# Altium project L电感测试仪.PRJPCB
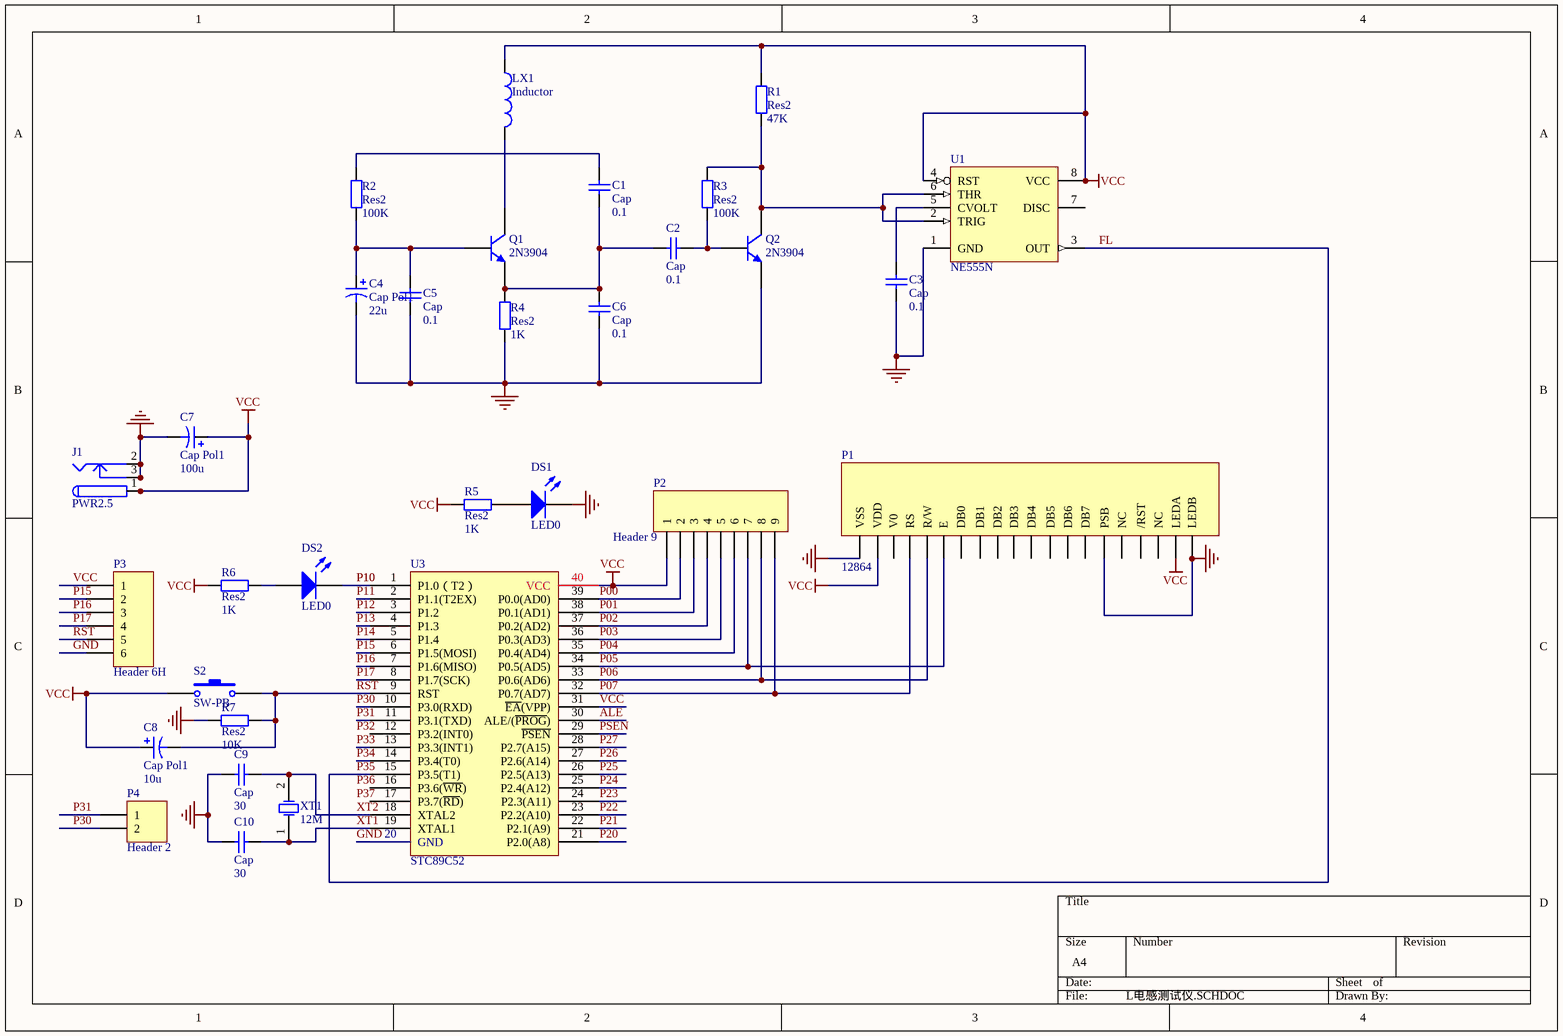
[diagram p0: L电感测试仪.SCHDOC]
1 sheet, 31 parts. Net scope: global (net labels, ports and power ports of the same name join across sheets).
Board file: L电感测试仪.PCBDOC

## Sheet L电感测试仪.SCHDOC
size A4

### Parts
C1  Cap  value 0.1  [RAD-0.2]
C2  Cap  value 0.1  [RAD-0.2]
C3  Cap  value 0.1  [RAD-0.2]
C4  Cap Pol1  value 22u  [电容]
C5  Cap  value 0.1  [RAD-0.2]
C6  Cap  value 0.1  [RAD-0.2]
C7  Cap Pol1  value 100u  [电容]
C8  Cap Pol1  value 10u  [电容]
C9  Cap  value 30  [RAD-0.1]
C10  Cap  value 30  [RAD-0.1]
DS1  LED0  [RAD-0.1]
DS2  LED0  [RAD-0.1]
J1  PWR2.5  [KLD-0202]
LX1  Inductor  [RAD-0.3]
P1  12864  [HDR1X20]
P2  Header 9  [HDR1X9]
P3  Header 6H  [HDR1X6]
P4  Header 2  [HDR1X2]
Q1  2N3904  [BCY-W3/E4]
Q2  2N3904  [BCY-W3/E4]
R1  Res2  value 47K  [AXIAL-0.4]
R2  Res2  value 100K  [AXIAL-0.4]
R3  Res2  value 100K  [AXIAL-0.4]
R4  Res2  value 1K  [AXIAL-0.4]
R5  Res2  value 1K  [AXIAL-0.4]
R6  Res2  value 1K  [AXIAL-0.4]
R7  Res2  value 10K  [AXIAL-0.4]
S2  SW-PB  [点动按键]
U1  NE555N  [DIP8]
U3  STC89C52  [AT89S52]
XT1  12M  [圆晶振]

### Nets
GND: C3.2 C4.2 C5.1 C6.1 C7.2 C9.1 C10.1 DS1.2(K) J1.2 J1.2A J1.2B J1.3 J1.3A J1.3B P1.1(VSS) P1.15(PSB) P1.20(LEDB) P3.6 Q2.1(E) R4.1 R7.1 U1.1(GND) U3.20(GND)
VCC: C7.1 C8.1 J1.1 J1.1A J1.1B LX1.1 P1.2(VDD) P1.19(LEDA) P2.1 P3.1 R1.2 R5.1 R6.2 S2.1 U1.4(RST) U1.8(VCC) U3.31(~{EA}(VPP)) U3.40(VCC)
ALE: U3.30(ALE/(~{PROG}))
FL: U1.3(OUT) U3.15(P3.5(T1))  [also labelled P35]
P00: P2.2 U3.39(P0.0(AD0))
P01: P2.3 U3.38(P0.1(AD1))
P02: P2.4 U3.37(P0.2(AD2))
P03: P2.5 U3.36(P0.3(AD3))
P04: P2.6 U3.35(P0.4(AD4))
P05: P1.6(E) P2.7 U3.34(P0.5(AD5))
P06: P1.5(R/W) P2.8 U3.33(P0.6(AD6))
P07: P1.4(RS) P2.9 U3.32(P0.7(AD7))
P10: DS2.2(K) U3.1(P1.0（T2）)
P11: U3.2(P1.1(T2EX))
P12: U3.3(P1.2)
P13: U3.4(P1.3)
P14: U3.5(P1.4)
P15: P3.2 U3.6(P1.5(MOSI))
P16: P3.3 U3.7(P1.6(MISO))
P17: P3.4 U3.8(P1.7(SCK))
P20: U3.21(P2.0(A8))
P21: U3.22(P2.1(A9))
P22: U3.23(P2.2(A10))
P23: U3.24(P2.3(A11))
P24: U3.25(P2.4(A12))
P25: U3.26(P2.5(A13))
P26: U3.27(P2.6(A14))
P27: U3.28(P2.7(A15))
P30: P4.2 U3.10(P3.0(RXD))
P31: P4.1 U3.11(P3.1(TXD))
P33: U3.13(P3.3(INT1))
P34: U3.14(P3.4(T0))
PSEN: U3.29(~{PSEN})
RST: C8.2 P3.5 R7.2 S2.2 U3.9(RST)
XT1: C10.2 U3.19(XTAL1) XT1.1(OSC1)
XT2: C9.2 U3.18(XTAL2) XT1.2(OSC2)
NetC1_1: C1.1 C2.2 C6.2 Q1.1(E) R4.2
NetC1_2: C1.2 R2.2
NetC2_1: C2.1 Q2.2(B) R3.2
NetC3_1: C3.1 U1.5(CVOLT)
NetC4_1: C4.1 C5.2 Q1.2(B) R2.1
NetDS1_1: DS1.1(A) R5.2
NetDS2_1: DS2.1(A) R6.1
NetLX1_2: LX1.2 Q1.3(C)
NetQ2_3: Q2.3(C) R1.1 R3.1 U1.2(TRIG) U1.6(THR)

Not connected (* = marked no-connect by the designer): P1 3(V0) 7(DB0) 8(DB1) 9(DB2) 10(DB3) 11(DB4) 12(DB5) 13(DB6) 14(DB7) 16(NC) 17(/RST) 18(NC); U1 7(DISC); U3 12(P3.2(INT0)) 16(P3.6(~{WR})) 17(P3.7(~{RD}))

### Notes on the sheet
- Labels drawn without touching a wire or pin: P32, P36, P37

### Library data of the parts
C1-C3 C5 C6 C9 C10 = Cap: Capacitor; Published: 8-Jun-2000; LatestRevisionDate: 17-Jul-2002; LatestRevisionNote: Re-released for DXP Platform.; Publisher: Altium Limited
C4 C7 C8 = Cap Pol1: Polarized Capacitor (Radial); Published: 8-Jun-2000; LatestRevisionDate: 17-Jul-2002; LatestRevisionNote: Re-released for DXP Platform.; Publisher: Altium Limited
DS1 DS2 = LED0: Typical INFRARED GaAs LED; Published: 8-Jun-2000; LatestRevisionDate: 17-Jul-2002; LatestRevisionNote: Re-released for DXP Platform.; Publisher: Altium Limited
J1 = PWR2.5: Low Voltage Power Supply Connector; Published: 17-Dec-2003; DatasheetDocument: 09-May-2002; Publisher: Altium Limited
LX1 = Inductor: Code_IEC: 1005; Published: 8-Jun-2000; LatestRevisionDate: 17-Jul-2002; LatestRevisionNote: Re-released for DXP Platform.; PackageReference: 0402-A; Publisher: Altium Limited; Code_JEITA: 0402
P2 = Header 9: Header, 9-Pin; LatestRevisionDate: 17-Jul-2002; LatestRevisionNote: Re-released for DXP Platform.; Publisher: Altium Limited
P3 = Header 6H: Header, 6-Pin, Right Angle; LatestRevisionDate: 17-Jul-2002; LatestRevisionNote: Re-released for DXP Platform.; Publisher: Altium Limited
P4 = Header 2: Header, 2-Pin; LatestRevisionDate: 17-Jul-2002; LatestRevisionNote: Re-released for DXP Platform.; Publisher: Altium Limited
Q1 Q2 = 2N3904: NPN General Purpose Amplifier; Published: 8-Jun-2000; LatestRevisionDate: 15-Jan-2003; LatestRevisionNote: PCB Footprint 'BCY-W3/D4.7' replaced; DatasheetDocument: 1997; PackageReference: TO-92A; Publisher: Altium Limited; Code_JEDEC: TO-92A
R1-R7 = Res2: Resistor; Published: 8-Jun-2000; LatestRevisionDate: 17-Jul-2002; LatestRevisionNote: Re-released for DXP Platform.; Publisher: Altium Limited
S2 = SW-PB: Switch; Published: 24-Mar-1999; LatestRevisionDate: 17-Jul-2002; LatestRevisionNote: Re-released for DXP Platform.; Publisher: Altium Limited
U1 = NE555N: General-Purpose Single Bipolar Timer; Published: 24-Aug-2001; LatestRevisionDate: 17-Jul-2002; LatestRevisionNote: Re-released for DXP Platform.; DatasheetDocument: Jul-1998; PackageReference: DIP8; Publisher: Altium Limited; Code_JEDEC: MO-001-AN
U3 = AT89S52
XT1 = XTAL2